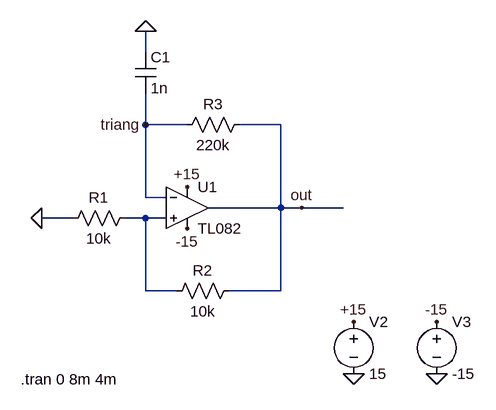
[diagram p0: schematic astable_multivibrator.asc]
astable_multivibrator.asc, the LTspice schematic file:
Version 4
SHEET 1 1288 680
WIRE 128 -144 128 -176
WIRE 128 -32 128 -80
WIRE 192 -32 128 -32
WIRE 336 -32 272 -32
WIRE 128 80 128 -32
WIRE 160 80 128 80
WIRE 336 96 336 -32
WIRE 336 96 224 96
WIRE 368 96 336 96
WIRE 432 96 368 96
WIRE 16 112 -32 112
WIRE 128 112 96 112
WIRE 160 112 128 112
WIRE 128 224 128 112
WIRE 176 224 128 224
WIRE 336 224 336 96
WIRE 336 224 256 224
FLAG 448 352 0
FLAG 576 352 0
FLAG 448 272 +15
FLAG 576 272 -15
FLAG 192 64 +15
FLAG 192 128 -15
FLAG -32 112 0
FLAG 128 -176 0
FLAG 128 -32 triang
FLAG 368 96 out
SYMBOL voltage 448 256 R0
WINDOW 123 0 0 Left 0
WINDOW 39 0 0 Left 0
SYMATTR InstName V2
SYMATTR Value 15
SYMBOL voltage 576 256 R0
WINDOW 123 0 0 Left 0
WINDOW 39 0 0 Left 0
SYMATTR InstName V3
SYMATTR Value -15
SYMBOL TL082 192 96 R0
SYMATTR InstName U1
SYMBOL res 112 96 R90
WINDOW 0 0 56 VBottom 2
WINDOW 3 32 56 VTop 2
SYMATTR InstName R1
SYMATTR Value 10k
SYMBOL res 272 208 R90
WINDOW 0 0 56 VBottom 2
WINDOW 3 32 56 VTop 2
SYMATTR InstName R2
SYMATTR Value 10k
SYMBOL res 288 -48 R90
WINDOW 0 0 56 VBottom 2
WINDOW 3 32 56 VTop 2
SYMATTR InstName R3
SYMATTR Value 220k
SYMBOL cap 112 -144 R0
SYMATTR InstName C1
SYMATTR Value 1n
TEXT -64 360 Left 2 !.tran 0 8m 4m

The netlist it stands for:
* astable_multivibrator.asc
V2 +15 0 15
V3 -15 0 -15
* U1: TL082 (symbol TL082 not available, pins judged from their places): In+=N001 In-=triang V+=+15 V-=-15 OUT=out
R1 N001 0 10k
R2 out N001 10k
R3 out triang 220k
C1 0 triang 1n
.tran 0 8m 4m
.backanno
.end